# Altium schematic sheet Sheet4.SchDoc
size A4; SheetNumber: 4; SheetTotal: 6
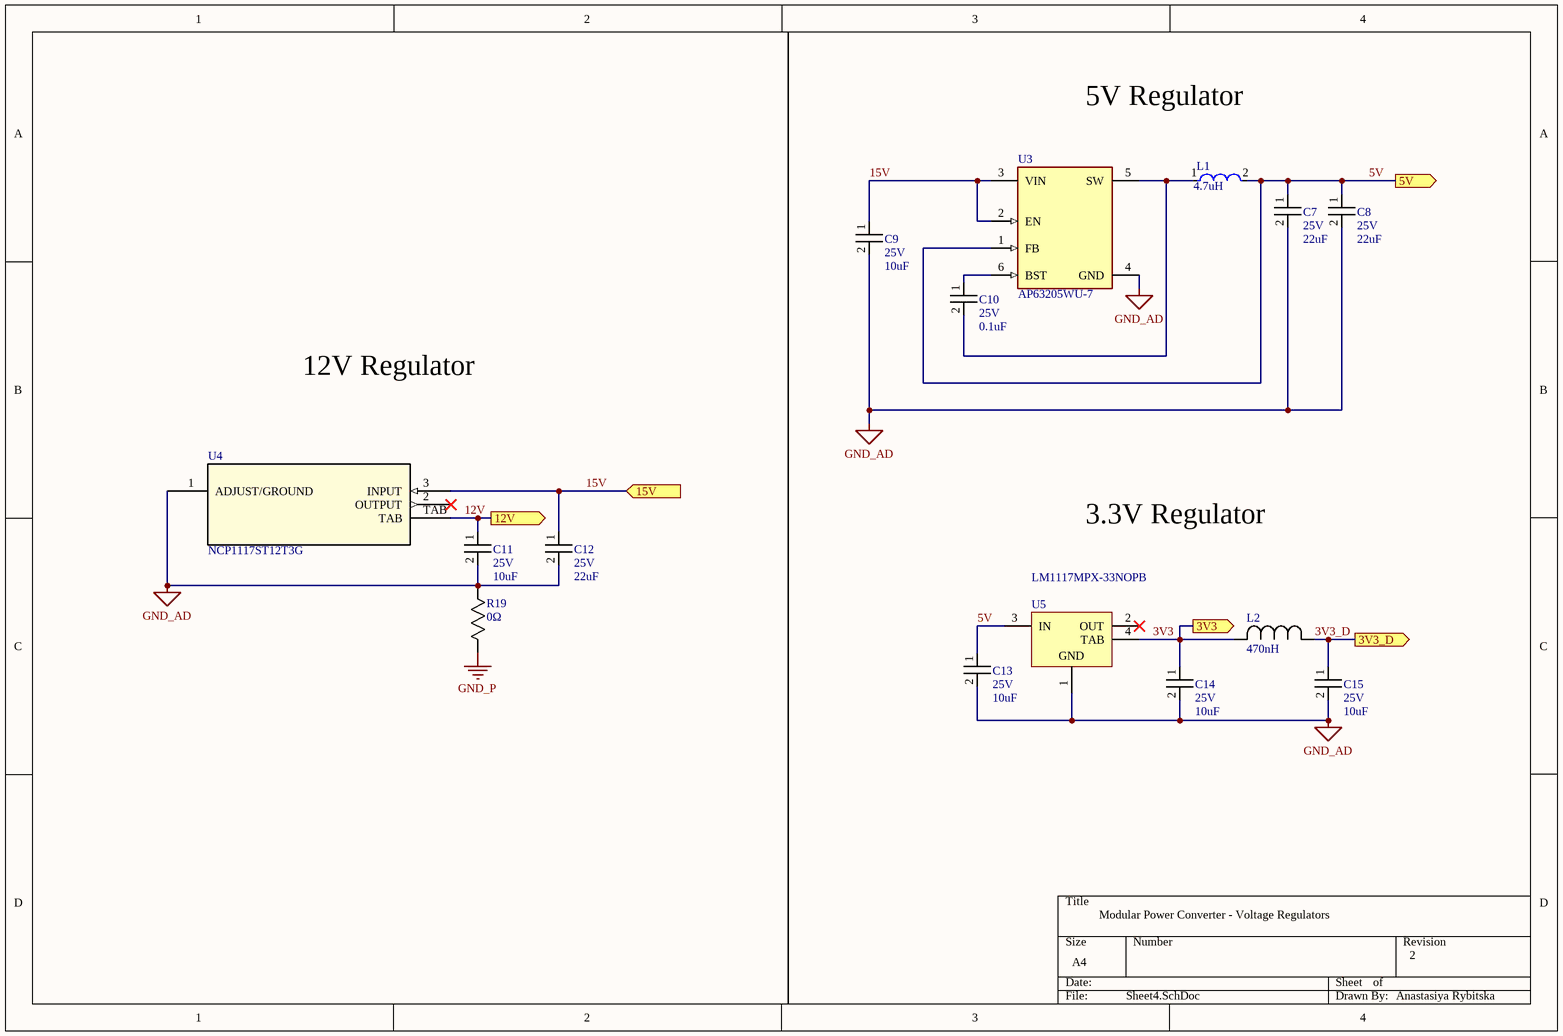
[diagram p0: Sheet4.SchDoc]

## Parts
C7  Voltage Rating: 25V  Capacitance: 22uF  [0805]  (hidden comment: CL21A226MAYNNNE)
C8  Voltage Rating: 25V  Capacitance: 22uF  [0805]  (hidden comment: CL21A226MAYNNNE)
C9  Voltage Rating: 25V  Capacitance: 10uF  [0805]  (hidden comment: TMK212BBJ106KG-T)
C10  Voltage Rating: 25V  Capacitance: 0.1uF  [0603]  (hidden comment: CC0603MRX7R8BB104)
C11  Voltage Rating: 25V  Capacitance: 10uF  [0805]  (hidden comment: TMK212BBJ106KG-T)
C12  Voltage Rating: 25V  Capacitance: 22uF  [0805]  (hidden comment: CL21A226MAYNNNE)
C13  Voltage Rating: 25V  Capacitance: 10uF  [0805]  (hidden comment: TMK212BBJ106KG-T)
C14  Voltage Rating: 25V  Capacitance: 10uF  [0805]  (hidden comment: TMK212BBJ106KG-T)
C15  Voltage Rating: 25V  Capacitance: 10uF  [0805]  (hidden comment: TMK212BBJ106KG-T)
L1  Inductance: 4.7uH  [FP-MLZ2012-0_85-IPC_B]  (hidden comment: MLZ2012M4R7WT000)
L2  Inductance: 470nH  [0805]  (hidden comment: MLZ2012DR47DT000)
R19  Resistance: 0Ω  [0603]  (hidden comment: AC0603FR-070RL)
U3  AP63205WU-7  [FP-TSOT26-MFG]
U4  NCP1117ST12T3G  [SOT223-3_ONS]
U5  LM1117MPX-33NOPB  [DCY0004A_L]

## Ports
3V3 (out), 3V3_D (out), 5V (out), 12V (out), 15V (in)

## Nets
GND_AD: C7.2 C8.2 C9.2 C11.2 C12.2 C13.2 C14.2 C15.2 R19.1 U3.4(GND) U4.1(ADJUST/GROUND) U5.1(GND)
GND_P: R19.2
3V3: C14.1 L2.2 U5.4(TAB) ; port 3V3
3V3_D: C15.1 L2.1 ; port 3V3_D
5V: C7.1 C8.1 C13.1 L1.2 U3.1(FB) U5.3(IN) ; port 5V
12V: C11.1 U4.TAB ; port 12V
15V: C9.1 C12.1 U3.2(EN) U3.3(VIN) U4.3(INPUT) ; port 15V
NetC10_1: C10.1 U3.6(BST)
NetC10_2: C10.2 L1.1 U3.5(SW)

Not connected (* = marked no-connect by the designer): U4 2(OUTPUT)*; U5 2(OUT)*

## Notes on the sheet
- 5V Regulator
- 12V Regulator
- 3.3V Regulator
- Modular Power Converter - Voltage Regulators
- 2
- Anastasiya Rybitska

## Library data of the parts
C7 C8 C12 = TMK212BBJ106KG-T: 22 µF ±20% 25V Ceramic Capacitor X5R 0805 (2012 Metric)
C9 C11 C13-C15 = TMK212BBJ106KG-T: Multilayer Ceramic Capacitor 10uF 25V X5R 10% SMD 0805 T/R
C10 = CC0603MRX7R8BB104: CAP CER 0.1UF 25V X7R 0603
L1 = CMP-08253-000349-1: Shielded Multilayer Inductor 4.7uH ±20% 500mA 390mΩ SMD 0805; Self Resonant Frequency: 70MHz; Saturation Current: 180mA; Test Frequency: 2MHz; Core Material: Ferrite; DC Resistance (DCR): 390mR; Current Rating: 500mA; Length: 0.079inch; Case Code (Imperial): 0805; Mount: Surface Mount; Max Operating Temperature: 125°C; RoHS Compliant: Yes; Case Code (Metric): 2012; Lead Free: Lead Free; Height - Seated (Max): 0.041inch; Shielding: Shielded; Packaging: Tape and Reel; Package Quantity: 1; Min Operating Temperature: -55°C; Case/Package: 0805; Tolerance: 20%; Width: 0.049inch
L2 = MLZ2012DR47DT000: Shielded Multilayer Inductor 470nH ±20% 700mA 234mΩ SMD 0805
R19 = AC0603FR-070RL: RES SMD 0 OHM JUMPER 1/10W 0603
U3 = CMP-12757-000001-1: IC REG BUCK 5V 2A TSOT26; Manufacturer: Diodes Inc.; Max Junction Temp: +160°C; Max Duty Cycle: 100%; Standoff Height: 0.01mm; Max Supply Voltage: 32V; Number Of Outputs: 1; Min Supply Voltage: 3.8V; Output Type: Fixed; Switching Frequency: 1100kHz; Nominal Supply Current: 22uA; Automotive: No; RoHS: TRUE; Switching Topology: Buck; Temperature: -40°C to +85°C; Footprint Url: https://www.diodes.com/assets/Package-Files/TSOT26.pdf; Lead Free: Yes; Digikey Description: IC REG BUCK 5V 2A TSOT26; Device Class L3: Voltage Regulators - Switching; Ambient Temperature Range High: +85°C; Category: IC; Package: TSOT26; Output Voltage: 5V; Output Current: 2A; ComponentLink2Description: Datasheet; Device Class L2: Power Management ICs; Ambient Temperature Range Low: -40°C; Temperature Range High: +85°C; Temperature Range Low: -40°C; Octopart: https://octopart.com/ap63205wu-7-diodes+inc.-98099551; Manufacturer Part Number: AP63205WU-7; Height: 1mm; Device Class L1: Integrated Circuits (ICs); ComponentLink2URL: https://www.diodes.com/assets/Datasheets/AP63200-AP63201-AP63203-AP63205.pdf
U4 = NCP1117ST12T3G: No Description Available; Mfr_Name: onsemi; Copyright: Copyright (C) 2022 Ultra Librarian. All rights reserved.; Manufacturer_Part_Number: NCP1117ST12T3G; Digi-Key_Part_Number_1: 2156-NCP1117ST12T3G-OS-ND; Digi-Key_Part_Number_2: =NCP1117ST12T3G; Digi-Key_Part_Number_3: NCP1117ST12T3GOSCT-ND; Digi-Key_Part_Number_4: NCP1117ST12T3GOSDKR-ND; Digi-Key_Part_Number_5: NCP1117ST12T3GOSTR-ND; RefDes: RefDes; Type: DEV
U5 = CMP-0062-01639-4: IC REG LINEAR 3.3V 800MA SOT223; Manufacturer: onsemi; High-Reliability: Y; PowerWise: N; PackageTopMarking: XYTT*N05A; CompType: LDO IC; ComponentLink1URL: http://www.ti.com/general/docs/lit/getliterature.tsp?genericPartNumber=LM1117-N&fileType=pdf; PartNumber: LM1117MPX-33NOPB; ComponentLink1Description: Datasheet URL; PinCount: 4; Code_JEDEC: TO-261-AA; PackageDescription: Molded SOT-223, 6.50 x 3.56 x 1.6mm Body, 4 Lead, 2.3mm Pitch; PackageReference: DCY0004A; RoHS: Y; Code_IPC: SOT223-4